# Altium schematic sheet MAX5841_DAC_MAX1037_ADC.SchDoc
size A
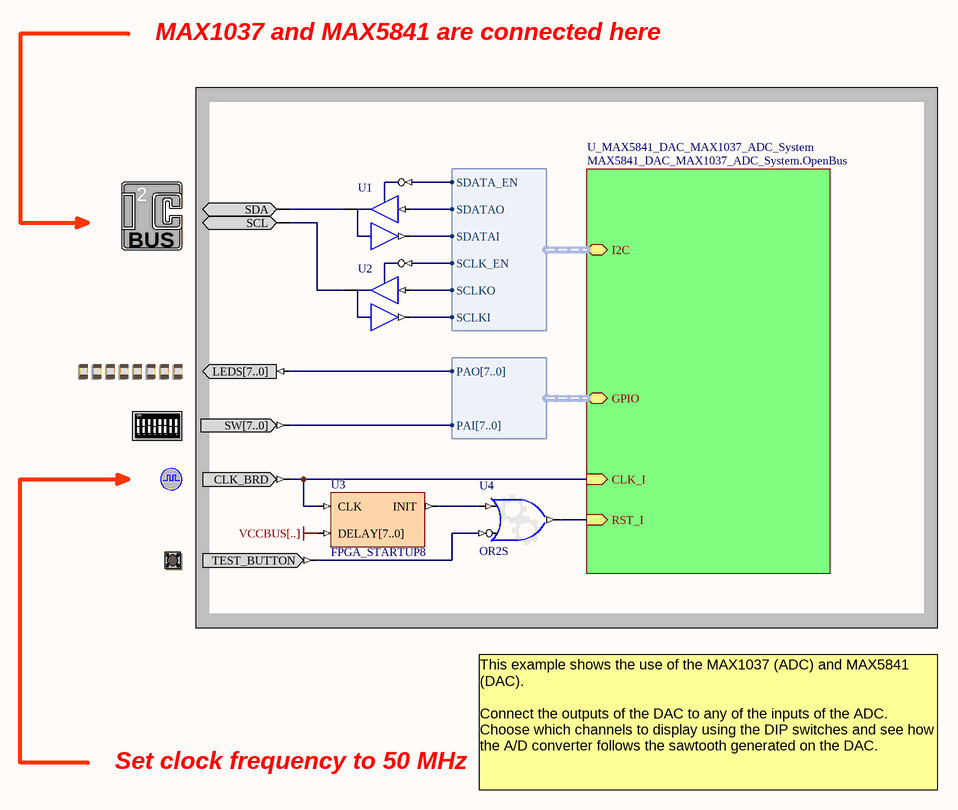
[diagram p0: MAX5841_DAC_MAX1037_ADC.SchDoc]

## Parts
(Parts that share a designator on the sheet are numbered #1, #2 ... from top to bottom, then left to right.)
?#1  I2C_BUS  (value not drawn)
?#2  LED  (value not drawn)
?#3  DIPSWITCH  (value not drawn)
?#4  CLOCK_BOARD  (value not drawn)
?#5  TEST_BUTTON  (value not drawn)
U1  IOBUF  (value not drawn)
U2  IOBUF  (value not drawn)
U3  FPGA_STARTUP8
U4  OR2S

## Sub-sheets
U_MAX5841_DAC_MAX1037_ADC_System = MAX5841_DAC_MAX1037_ADC_System.OpenBus: RST_I (in), CLK_I (in), I2C (harness WB_I2CM), GPIO (harness WB_PRTIO_IO_1_1)

## Harnesses
WB_I2CM: SDATA_EN, SDATAO, SDATAI, SCLK_EN, SCLKO, SCLKI
WB_PRTIO_IO_1_1: PAO[7..0], PAI[7..0]

## Nets
VCCBUS[..]: U3.DELAY[7..0]
Net?#1_SCL: ?#1.SCL U2.IO
Net?#1_SDA: ?#1.SDA U1.IO
Net?#2_LEDS[7..0]: ?#2.LEDS[7..0] ; sheet U_MAX5841_DAC_MAX1037_ADC_System/GPIO.PAO[7..0]
Net?#3_SW[7..0]: ?#3.SW[7..0] ; sheet U_MAX5841_DAC_MAX1037_ADC_System/GPIO.PAI[7..0]
Net?#4_CLK_BRD: ?#4.CLK_BRD U3.CLK ; sheet U_MAX5841_DAC_MAX1037_ADC_System/CLK_I
Net?#5_TEST_BUTTON: ?#5.TEST_BUTTON U4.I1
NetU1_I: U1.I ; sheet U_MAX5841_DAC_MAX1037_ADC_System/I2C.SDATAO
NetU1_O: U1.O ; sheet U_MAX5841_DAC_MAX1037_ADC_System/I2C.SDATAI
NetU1_T: U1.T ; sheet U_MAX5841_DAC_MAX1037_ADC_System/I2C.SDATA_EN
NetU2_I: U2.I ; sheet U_MAX5841_DAC_MAX1037_ADC_System/I2C.SCLKO
NetU2_O: U2.O ; sheet U_MAX5841_DAC_MAX1037_ADC_System/I2C.SCLKI
NetU2_T: U2.T ; sheet U_MAX5841_DAC_MAX1037_ADC_System/I2C.SCLK_EN
NetU3_INIT: U3.INIT U4.I0
NetU4_O: U4.O ; sheet U_MAX5841_DAC_MAX1037_ADC_System/RST_I

## Notes on the sheet
- MAX1037 and MAX5841 are connected here
- Set clock frequency to 50 MHz
- This example shows the use of the MAX1037 (ADC) and MAX5841 (DAC).
  Connect the outputs of the DAC to any of the inputs of the ADC. Choose which channels to display using the DIP switches and see how the A/D converter follows the sawtooth generated on the DAC.
- Title
- Size:
- Date:
- A
- Number:
- Time:
- Revision:
- Sheet
- of
- File:
- (in symbol DIPSWITCH) ON; 1; 2; 3; 4; 5; 6; 7; 8
- (in symbol I2C_BUS) 2; BUS

## Library data of the parts
?#1 = I2C_BUS: I2C Bus Interface; PortComponent: True; Published: 22-Jan-2007; Publisher: Altium Limited; HelpURL: TR0143 Technical Reference Manual for Altium's Desktop NanoBoard NB2DSK01.pdf#page=55
?#2 = LED: Bank of eight Red LEDs; PortComponent: True; Published: 19-Nov-2003; Publisher: Altium Limited; HelpURL: TR0143 Technical Reference Manual for Altium's Desktop NanoBoard NB2DSK01.pdf#page=51
?#3 = DIPSWITCH: 8-Way Dip-Switch; PortComponent: True; Published: 19-Nov-2003; Publisher: Altium Limited; HelpURL: TR0143 Technical Reference Manual for Altium's Desktop NanoBoard NB2DSK01.pdf#page=51
?#4 = CLOCK_BOARD: Global System Clock Supply; PortComponent: True; Published: 19-Nov-2003; Publisher: Altium Limited; HelpURL: TR0143 Technical Reference Manual for Altium's Desktop NanoBoard NB2DSK01.pdf#page=41; UseInDSF: True
?#5 = TEST_BUTTON: Test / Reset Button; PortComponent: True; Published: 19-Nov-2003; Publisher: Altium Limited; HelpURL: TR0143 Technical Reference Manual for Altium's Desktop NanoBoard NB2DSK01.pdf#page=53
U1 U2 = IOBUF: Input/Output Buffer; Enable: Low; Control: Common Control T; ArchiveName: GENERIC; VHDLIB_SIM: GENERIC_LIB; Published: 29-Jan-2004; Publisher: Altium Limited; XilinxEquivalent: IOBUF; LastRevisionNo: 1.00.00; HelpURL: CR0118 FPGA Generic Library Guide.pdf#page=293; ComponentLink1URL: CR0125 FPGA Buffer Resource Usage.pdf#page=78; ComponentLink1Description: Core &Resource Usage; FunctionalClass: Buffer; SubClass: IOBUF
U3 = FPGA_STARTUP8: FPGA Startup With 8 Bit Delay; Published: 9-Dec-2004; Publisher: Altium Limited; HelpURL: CR0119 FPGA_STARTUPx Powerup Delay Unit.pdf; LastRevisionNo: 1.00.00; ComponentLink1Description: Core &Resource Usage; ComponentLink1URL: CR0139 FPGA Peripheral Resource Usage.pdf#page=11
U4 = GATE: Configurable Generic Gate; ConfiguratorName: GENERIC_GATE; ConfigurationParameters: {}Version[1.0]{}GateKind[OR]{}BusInput[False]{}GateInputType[Bit]{}GateOutputOption[Normal]{}BusWidth[8]{}RegisterOutputs[False]{}NegativeClockEdge[False]{}InputCount[2]{}InputInvert0[False]{}InputInvert1[True]{}; LastRevisionNo: 1.00.00; Published: 3-Sep-2008; Publisher: Altium Limited